# Altium schematic sheet Brightness_Sensor_Schematic.SchDoc
size A4; DocumentNumber: 6; SheetNumber: 6; SheetTotal: 6
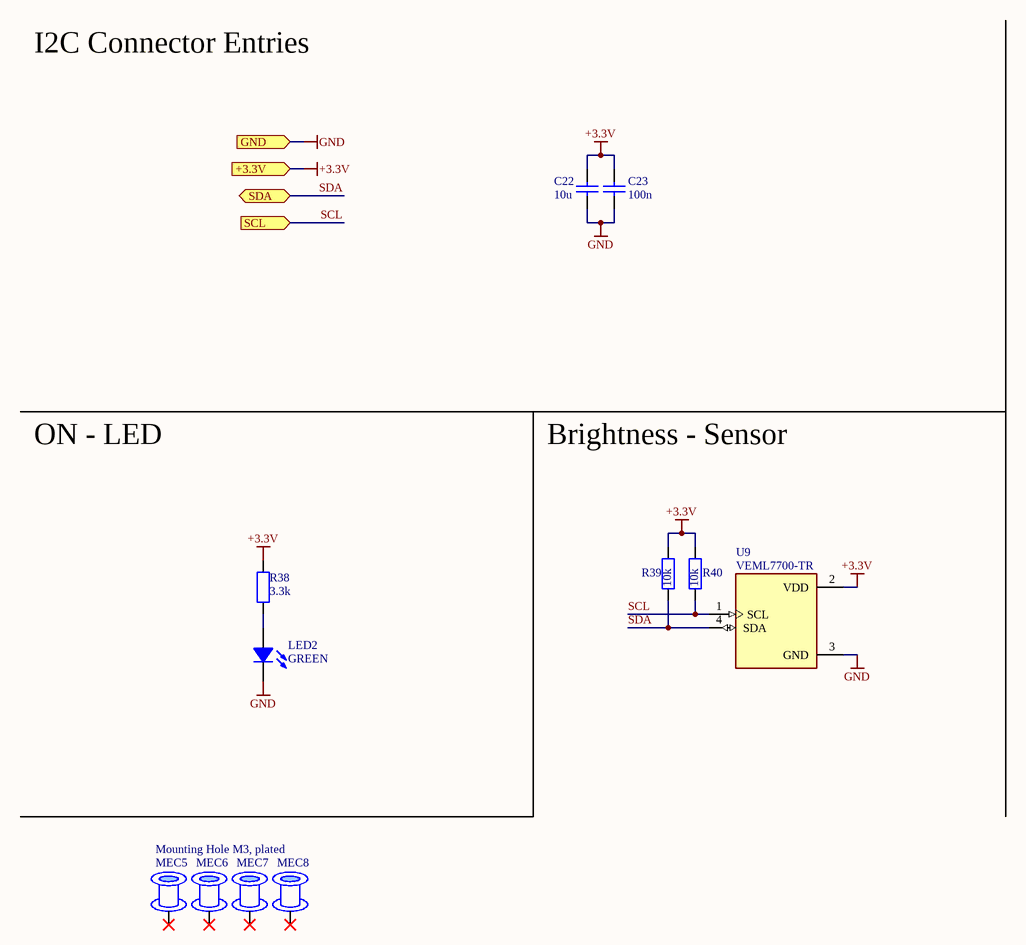
[diagram p0: Brightness_Sensor_Schematic.SchDoc]

## Parts
C22  10u  [0603_CAPACITOR]
C23  100n  [0603_CAPACITOR]
LED2  GREEN  [LED_0603, GREEN]
MEC5  Mounting Hole M3, plated  [Mounting Hole M3, plated]
MEC6  Mounting Hole M3, plated  [Mounting Hole M3, plated]  (value not drawn)
MEC7  Mounting Hole M3, plated  [Mounting Hole M3, plated]  (value not drawn)
MEC8  Mounting Hole M3, plated  [Mounting Hole M3, plated]  (value not drawn)
R38  3.3k  [0603_Resistor]
R39  10k  [0603_Resistor]
R40  10k  [0603_Resistor]
U9  VEML7700-TR  [Brightness_Sensor]

## Ports
+3.3V (in), GND (in), SCL (in), SDA (bidir)

## Nets
+3.3V: C22.2 C23.2 R38.2 R39.2 R40.2 U9.2(VDD) ; port +3.3V
GND: C22.1 C23.1 LED2.K U9.3(GND) ; port GND
SCL: R40.1 U9.1(SCL) ; port SCL
SDA: R39.1 U9.4(SDA) ; port SDA
NetLED2_A: LED2.A R38.1

Not connected (* = marked no-connect by the designer): MEC5 1*; MEC6 1*; MEC7 1*; MEC8 1*

## Notes on the sheet
- I2C Connector Entries
- ON - LED
- Brightness - Sensor
- Date:
- Title of drawing:
- Time:
- Drawn by:
- Project:
- Revision:
- Institut:
- Departement:
- Page:
- from:
- File:

## Library data of the parts
C22 C23 = Capacitor: 0603
LED2 = LED_0603, GREEN: LED 0603, Green, 3.2 V, 20 mA, 430 mcd
MEC5-MEC8 = Mounting Hole M3, plated: Mounting Hole for M3 Screw, plated to connect signal
R38-R40 = Resistor: 0603
U9 = Brightness_Sensor: SENSOR OPT 545NMAMB 4 SMD J LEAD.; ComponentLink1Description: Supplier; ComponentLink1URL: https://www.digikey.ch/en/products/detail/vishay-semiconductor-opto-division/VEML7700-TR/5820243